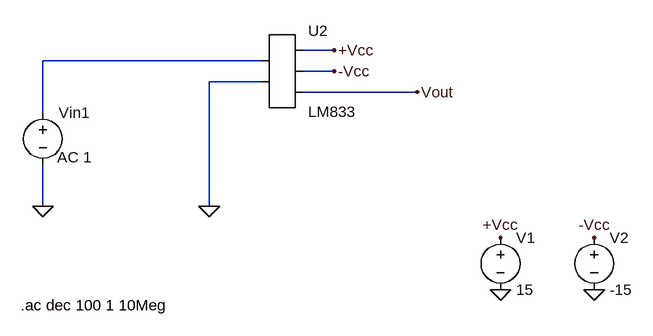
[diagram p0: schematic opamp LM833 (solo, para ver la transferencia de Av).asc]
opamp LM833 (solo, para ver la transferencia de Av).asc, the LTspice schematic file:
Version 4
SHEET 1 1428 680
WIRE 960 0 912 0
WIRE 848 16 512 16
WIRE 960 32 912 32
WIRE 848 48 768 48
WIRE 1088 64 912 64
WIRE 512 96 512 16
WIRE 512 240 512 176
WIRE 768 240 768 48
FLAG 960 0 +Vcc
FLAG 960 32 -Vcc
FLAG 768 240 0
FLAG 512 240 0
FLAG 1088 64 Vout
FLAG 1216 368 0
FLAG 1360 368 0
FLAG 1216 288 +Vcc
FLAG 1360 288 -Vcc
SYMBOL AutoGenerated\\LM833 880 32 R0
SYMATTR InstName U2
SYMBOL voltage 512 80 R0
WINDOW 123 22 84 Left 2
WINDOW 39 0 0 Left 0
SYMATTR InstName Vin1
SYMATTR Value ""
SYMATTR Value2 AC 1
SYMBOL voltage 1216 272 R0
SYMATTR InstName V1
SYMATTR Value 15
SYMBOL voltage 1360 272 R0
SYMATTR InstName V2
SYMATTR Value -15
TEXT 478 392 Left 2 !.ac dec 100 1 10Meg

The netlist it stands for:
* opamp LM833 (solo, para ver la transferencia de Av).asc
* U2: LM833 (symbol AutoGenerated\LM833 not available, pins judged from their places): pin1=N001 pin2=0 pin3=+Vcc pin4=-Vcc pin5=Vout
Vin1 N001 0 AC 1
V1 +Vcc 0 15
V2 -Vcc 0 -15
.ac dec 100 1 10Meg
.backanno
.end